# Altium schematic sheet Power_5V_Rev1.1.SchDoc
size B
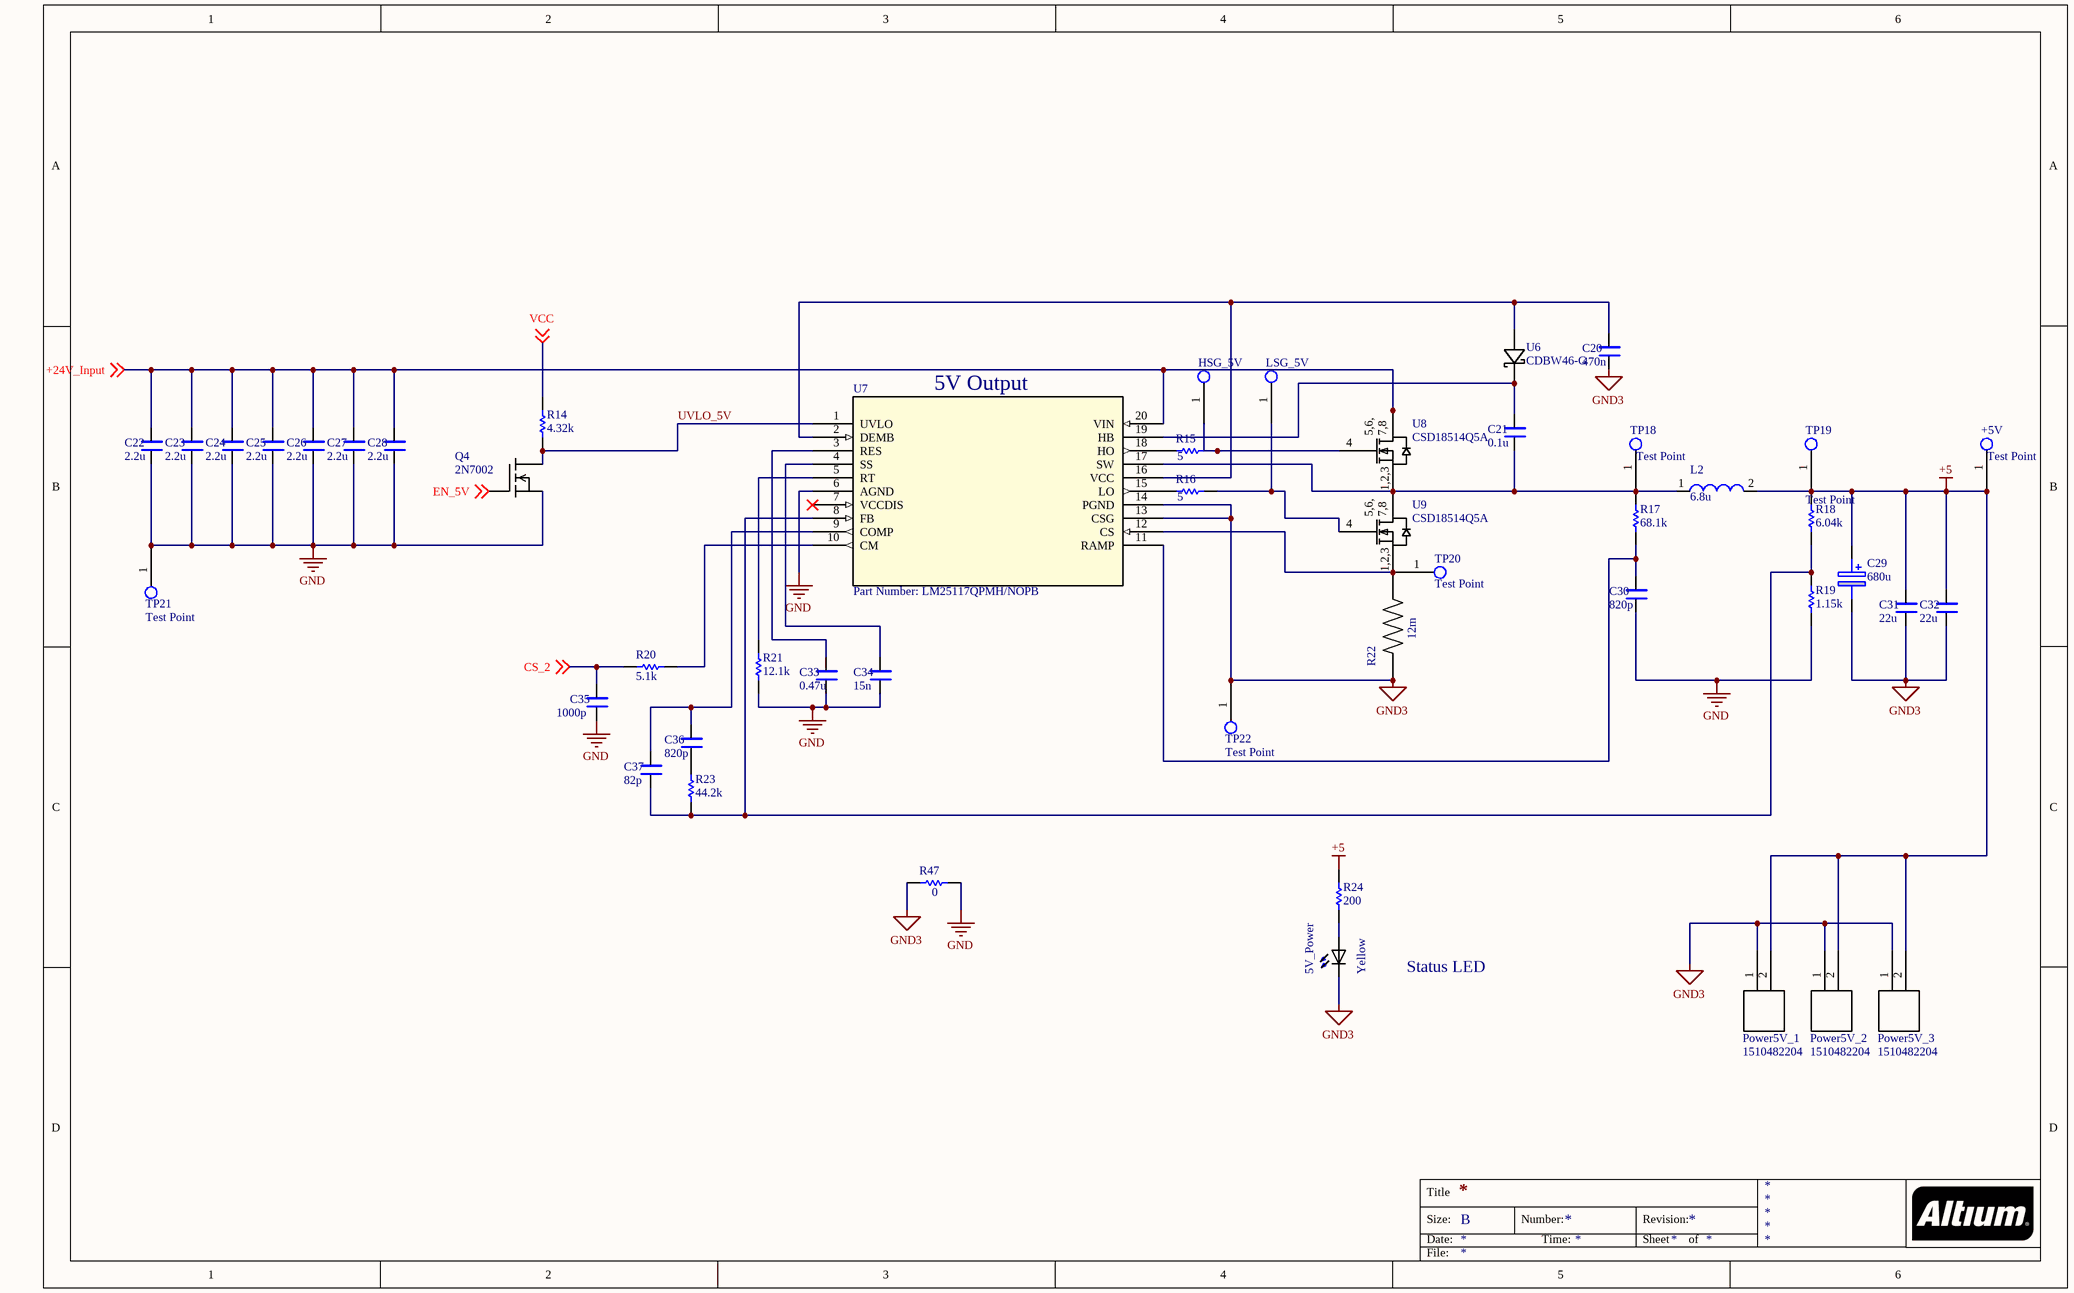
[diagram p0: Power_5V_Rev1.1.SchDoc]

## Parts
5V_Power  Yellow  [*DIOC200X125X110_LTST-C171KSKT(Primary)]
+5V  Test Point  [Test Point Through-hole]
C20  470n  [*CAPC2012X88N]
C21  0.1u  [*CAPC2012X88N]
C22  2.2u  [*CAPC2012X88N]
C23  2.2u  [*CAPC2012X88N]
C24  2.2u  [*CAPC2012X88N]
C25  2.2u  [*CAPC2012X88N]
C26  2.2u  [*CAPC2012X88N]
C27  2.2u  [*CAPC2012X88N]
C28  2.2u  [*CAPC2012X88N]
C29  680u  [CAPPRD500W65D1000H1800]
C30  820p  [*CAPC2012X88N]
C31  22u  [*CAPC2012X88N]
C32  22u  [*CAPC2012X88N]
C33  0.47u  [*CAPC2012X88N]
C34  15n  [*CAPC2012X88N]
C35  1000p  [*CAPC2012X88N]
C36  820p  [*CAPC2012X88N]
C37  82p  [*CAPC2012X88N]
HSG_5V  (no value)  [Test Point Through-hole]
L2  6.8u  [XAL1010-682]
LSG_5V  (no value)  [Test Point Through-hole]
Power5V_1  1510482204  [1510482204]
Power5V_2  1510482204  [1510482204]
Power5V_3  1510482204  [1510482204]
Q4  2N7002  [*SOT23]
R14  4.32k  [RESC0805(2012)_M]
R15  5  [AXIAL-0.3]
R16  5  [AXIAL-0.3]
R17  68.1k  [RESC0805(2012)_M]
R18  6.04k  [RESC0805(2012)_M]
R19  1.15k  [RESC0805(2012)_M]
R20  5.1k  [RESC0805(2012)_M]
R21  12.1k  [RESC0805(2012)_M]
R22  12m  [*RESC6432X110N]
R23  44.2k  [RESC0805(2012)_M]
R24  200  [RESC0805(2012)_M]
R47  0  [RESC0805(2012)_M]
TP18  Test Point  [Test Point Through-hole]
TP19  Test Point  [Test Point Through-hole]
TP20  Test Point  [Test Point Through-hole]
TP21  Test Point  [Test Point Through-hole]
TP22  Test Point  [Test Point Through-hole]
U6  CDBW46-G  [CDBW]
U7  Part Number: LM25117QPMH/NOPB  [MXA20A]
U8  CSD18514Q5A  [DQJ0008A]
U9  CSD18514Q5A  [DQJ0008A]

## Nets
+5: +5V.1 C29.1(+) C31.2 C32.2 L2.2 Power5V_1.2 Power5V_2.2 Power5V_3.2 R18.2 R24.2 TP19.1
GND: C22.1 C23.1 C24.1 C25.1 C26.1 C27.1 C28.1 C30.1 C33.1 C34.1 C35.1 Q4.2(S) R19.1 R21.1 R47.1 TP21.1 U7.6(AGND)
GND3: 5V_Power.NEG C20.1 C29.2(-) C31.1 C32.1 Power5V_1.1 Power5V_2.1 Power5V_3.1 R22.1 R47.2 TP22.1 U7.13(CSG) U7.14(PGND)
+24V_Input: C22.2 C23.2 C24.2 C25.2 C26.2 C27.2 C28.2 U7.20(VIN) U8.5(D) U8.6(D) U8.7(D) U8.8(D) ; off-sheet +24V_Input
CS_2: C35.2 R20.2 ; off-sheet CS_2
EN_5V: Q4.1(G) ; off-sheet EN_5V
UVLO_5V: Q4.3(D) R14.1 U7.1(UVLO)
VCC: R14.2 ; off-sheet VCC
Net5V_Power_POS: 5V_Power.POS R24.1
NetC20_2: C20.2 U6.2 U7.2(DEMB) U7.16(VCC)
NetC21_1: C21.1 L2.1 R17.2 TP18.1 U7.17(SW) U8.1(S) U8.2(S) U8.3(S) U9.5(D) U9.6(D) U9.7(D) U9.8(D)
NetC21_2: C21.2 U6.1 U7.19(HB)
NetC30_2: C30.2 R17.1 U7.11(RAMP)
NetC33_2: C33.2 U7.3(RES)
NetC34_2: C34.2 U7.4(SS)
NetC36_1: C36.1 R23.2
NetC36_2: C36.2 C37.2 U7.9(COMP)
NetC37_1: C37.1 R18.1 R19.2 R23.1 U7.8(FB)
NetHSG_5V_1: HSG_5V.1 R15.2 U8.4(G)
NetLSG_5V_1: LSG_5V.1 R16.2 U9.4(G)
NetR15_1: R15.1 U7.18(HO)
NetR16_1: R16.1 U7.15(LO)
NetR20_1: R20.1 U7.10(CM)
NetR21_2: R21.2 U7.5(RT)
NetR22_2: R22.2 TP20.1 U7.12(CS) U9.1(S) U9.2(S) U9.3(S)

Not connected (* = marked no-connect by the designer): U7 7(VCCDIS)*

## Notes on the sheet
- (near U7) 5V Output
- Status LED
- Title
- Size:
- Date:
- B
- Number:
- Time:
- Revision:
- Sheet
- of
- File:
- (in symbol CSD18514Q5A) 5,6,; 7,8; 1,2,3

## Library data of the parts
5V_Power = LTST-C171KSKT: / Yellow 2 x 1.25 x 0.8 mm 130Â° Water Clear 50 mcd 2 V LED SMT /; MF: Lite-On Inc.; SnapEDA_Link: https://www.snapeda.com/parts/LTST-C171KSKT/Lite-On%20Inc./view-part/?ref=snap; Package: 0805 Lite-On; MP: LTST-C171KSKT; Digi-Key_Part_Number: 160-1428-1-ND; Digi-Key_Purchase_URL: https://www.digikey.com/product-detail/en/lite-on-inc/LTST-C171KSKT/160-1428-1-ND/386802?utm_source=snapeda&utm_medium=aggregator&utm_campaign=symbol; Value: *
C20-C28 C30-C37 = C0805C101JAGAC7800: / 100pF Â±5% 250V Ceramic Capacitor C0G, NP0 0805 _2012 Metric_ /; MF: KEMET; Package: 0805 KEMET; Digi-Key_Part_Number: 399-15000-1-ND; MP: C0805C101JAGAC7800; Digi-Key_Purchase_URL: https://www.digikey.com/product-detail/en/kemet/C0805C101JAGAC7800/399-15000-1-ND/7382549?utm_source=snapeda&utm_medium=aggregator&utm_campaign=symbol; SnapEDA_Link: https://www.snapeda.com/parts/C0805C101JAGAC7800/KEMET/view-part/3661430/?ref=snap; Value: *
C29 = EEUFC1V331: FC radial elec cap,330uF 35V Panasonic Aluminium Electrolytic Capacitor 330F 35 V dc 10mm Through Hole series FC Radial lifetime 3000h; Allied_Number: 70068521; Geometry.Height: 18mm; Manufacturer_Name: Panasonic; Manufacturer_Part_Number: EEUFC1V331; RS Part Number: 1081337; RS Price/Stock: http://uk.rs-online.com/web/p/products/1081337; Allied Price/Stock: https://www.alliedelec.com/panasonic-eeufc1v331/70068521/; Mouser Part Number: 1081337; Mouser Price/Stock: http://uk.rs-online.com/web/p/products/1081337; Datasheet Link: https://industrial.panasonic.com/cdbs/www-data/pdf/RDF0000/ABA0000C1209.pdf
HSG_5V LSG_5V = Test Point
L2 = SER2915H-153KL: Power inductor, high current, 10% tol, SMT, RoHS; MF: Coilcraft; Price: None; Package: None; SnapEDA_Link: https://www.snapeda.com/parts/SER2915H-153KL/Coilcraft/view-part/493862/?ref=snap; Availability: Unavailable; MP: SER2915H-153KL; Value: *
Power5V_1-Power5V_3 = 1510482204: Molex 6.5MM 2 pin connector, used for power connections. P/N 1510482204 and similar models.
Q4 = 2N7002: Trans MOSFET N-CH 60V 0.115A 3-Pin SOT-23 T/R; MF: ON Semiconductor; Price: None; SnapEDA_Link: https://www.snapeda.com/parts/2N7002/ON%20Semiconductor/view-part/4449003/?ref=snap; Availability: Unavailable; Package: SOT-23-3 ON Semiconductor; MP: 2N7002; Value: *
R14 R17-R21 R23 R24 R47 = CMP-1013-00951-1: 8M06 0.125W 1% 0805 (2012 Metric)  SMD; Value: 8060000.00 Ohm; Case-EIA: 0805; Case-Metric: 2012; Power: 0.125 W; Technology: SMT; Tolerance: 1 %
R15 R16 = 120R 5% 0805: 120R 0.125W 5% 0805 (2012 Metric)  SMD; Case-Metric: 2012; Value: 120.00 Ohm; Case-EIA: 0805; Tolerance: 5 %; Technology: SMT; Power: 0.125 W
R22 = ERJ-M1WSF12MU: Res Thick Film 2512 0.012 Ohm 1% 1W Pad SMD Automotive T/R; MF: Panasonic; MP: ERJ-M1WSF12MU; Package: 6432 Panasonic Electronic Components; Digi-Key_Purchase_URL: https://www.digikey.com/product-detail/en/panasonic-electronic-components/ERJ-M1WSF12MU/P12MCT-ND/300474?utm_source=snapeda&utm_medium=aggregator&utm_campaign=symbol; Digi-Key_Part_Number: P12MCT-ND; SnapEDA_Link: https://www.snapeda.com/parts/ERJ-M1WSF12MU/Panasonic/view-part/?ref=snap; Value: *
U6 = CDBW46-G: No Description Available; Vendor: Comchip; Built_By: EMA_UL_Team; Manufacturer_Part_Number: CDBW46-G; Copyright: Copyright (C) 2018 Accelerated Designs. All rights reserved; RefDes: RefDes; Type: DEV; Value: Value
U7 = LM25117QPMH/NOPB: No Description Available; Manufacturer: Texas Instruments; Built_By: EMA_UL_Team; Manufacturer_Part_Number: LM25117QPMH/NOPB; Vendor: Texas Instruments; Copyright: Copyright (C) 2018 Accelerated Designs. All rights reserved; RefDes: RefDes; Type: DEV; Value: Value
U8 U9 = CSD18514Q5A: No Description Available; Vendor: Texas Instruments; Built_By: Texas_Instrument_Team; Value: 40V; VALUE_2: Value; Manufacturer_Part_Number: CSD18514Q5A; Copyright: Copyright (C) 2018 Accelerated Designs. All rights reserved; RefDes: RefDes; Type: DEV